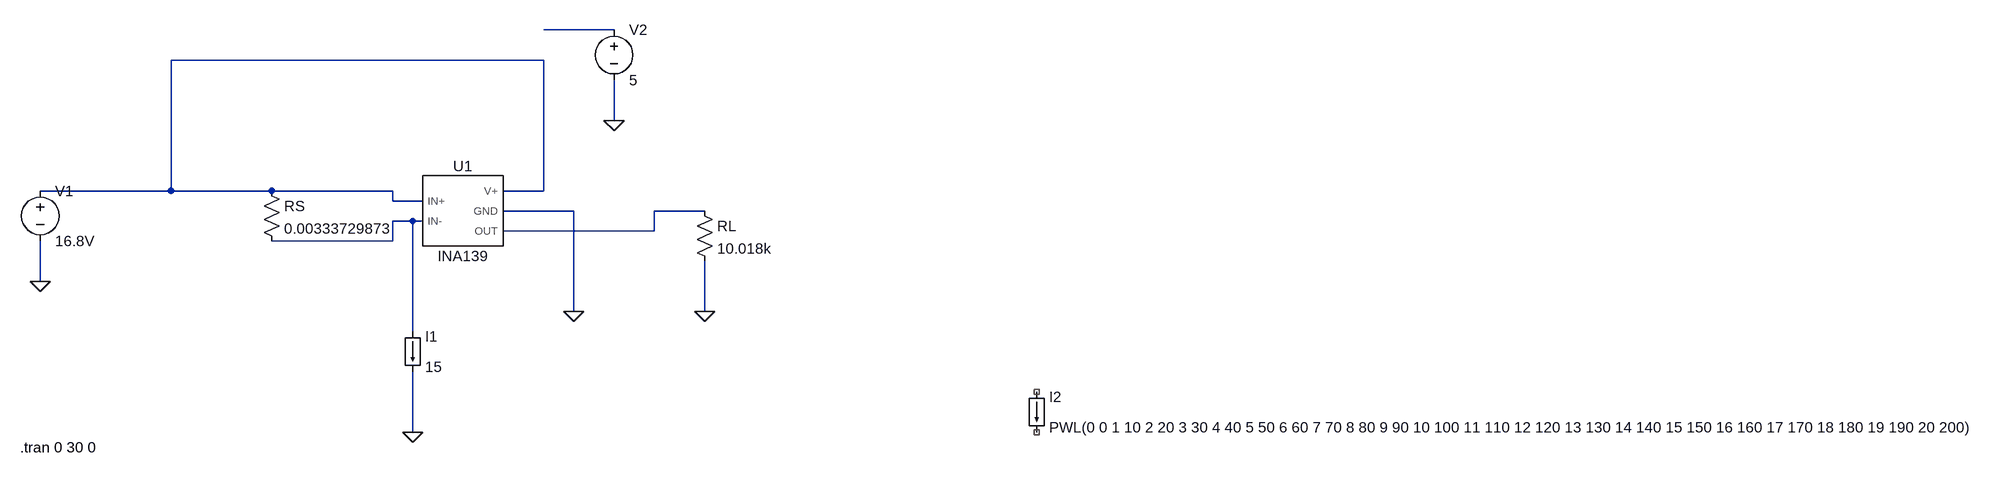
[diagram p0: schematic demo board.asc]
demo board.asc, the LTspice schematic file:
Version 4
SHEET 1 2744 680
WIRE 448 -128 336 -128
WIRE 336 -80 -256 -80
WIRE 448 16 448 -48
WIRE -256 128 -256 -80
WIRE -256 128 -464 128
WIRE -96 128 -256 128
WIRE 96 128 -96 128
WIRE 336 128 336 -80
WIRE 336 128 272 128
WIRE 96 144 96 128
WIRE 144 144 96 144
WIRE 384 160 272 160
WIRE 592 160 512 160
WIRE 128 176 96 176
WIRE 144 176 128 176
WIRE 512 192 512 160
WIRE 512 192 272 192
WIRE 96 208 96 176
WIRE 96 208 -96 208
WIRE -464 272 -464 208
WIRE 384 320 384 160
WIRE 592 320 592 240
WIRE 128 352 128 176
WIRE 128 512 128 416
FLAG 384 320 0
FLAG 592 320 0
FLAG 448 16 0
FLAG -464 272 0
FLAG 128 512 0
SYMBOL INA139 208 160 R0
SYMATTR InstName U1
SYMBOL res 576 144 R0
SYMATTR InstName RL
SYMATTR Value 10.018k
SYMATTR SpiceLine tol=1
SYMBOL res -112 112 R0
SYMATTR InstName RS
SYMATTR Value 0.00333729873
SYMBOL voltage -464 112 R0
WINDOW 123 0 0 Left 0
WINDOW 39 0 0 Left 0
SYMATTR InstName V1
SYMATTR Value 16.8V
SYMBOL voltage 448 -144 R0
WINDOW 123 0 0 Left 0
WINDOW 39 0 0 Left 0
SYMATTR InstName V2
SYMATTR Value 5
SYMBOL load 1104 448 R0
WINDOW 123 0 0 Left 0
WINDOW 39 0 0 Left 0
SYMATTR InstName I2
SYMATTR Value PWL(0 0 1 10 2 20 3 30 4 40 5 50 6 60 7 70 8 80 9 90 10 100 11 110 12 120 13 130 14 140 15 150 16 160 17 170 18 180 19 190 20 200)
SYMBOL load 112 352 R0
WINDOW 123 0 0 Left 0
WINDOW 39 0 0 Left 0
SYMATTR InstName I1
SYMATTR Value 15
TEXT -496 536 Left 2 !.tran 0 30 0

The netlist it stands for:
* demo board.asc
XU1 N002 N004 N002 0 N003 INA139  ; pins IN+ IN- V+ GND OUT
RL N003 0 10.018k tol=1
RS N002 N004 0.00333729873
V1 N002 0 16.8V
V2 N001 0 5
I2 NC_01 NC_02 PWL(0 0 1 10 2 20 3 30 4 40 5 50 6 60 7 70 8 80 9 90 10 100 11 110 12 120 13 130 14 140 15 150 16 160 17 170 18 180 19 190 20 200)
I1 N004 0 15
.tran 0 30 0
.lib C:\Users\tomix\Documents\GitHub\SeniorDesign-Team9\Simulations\INA169 - LTSpice\symbol\ina139.lib
.backanno
.end